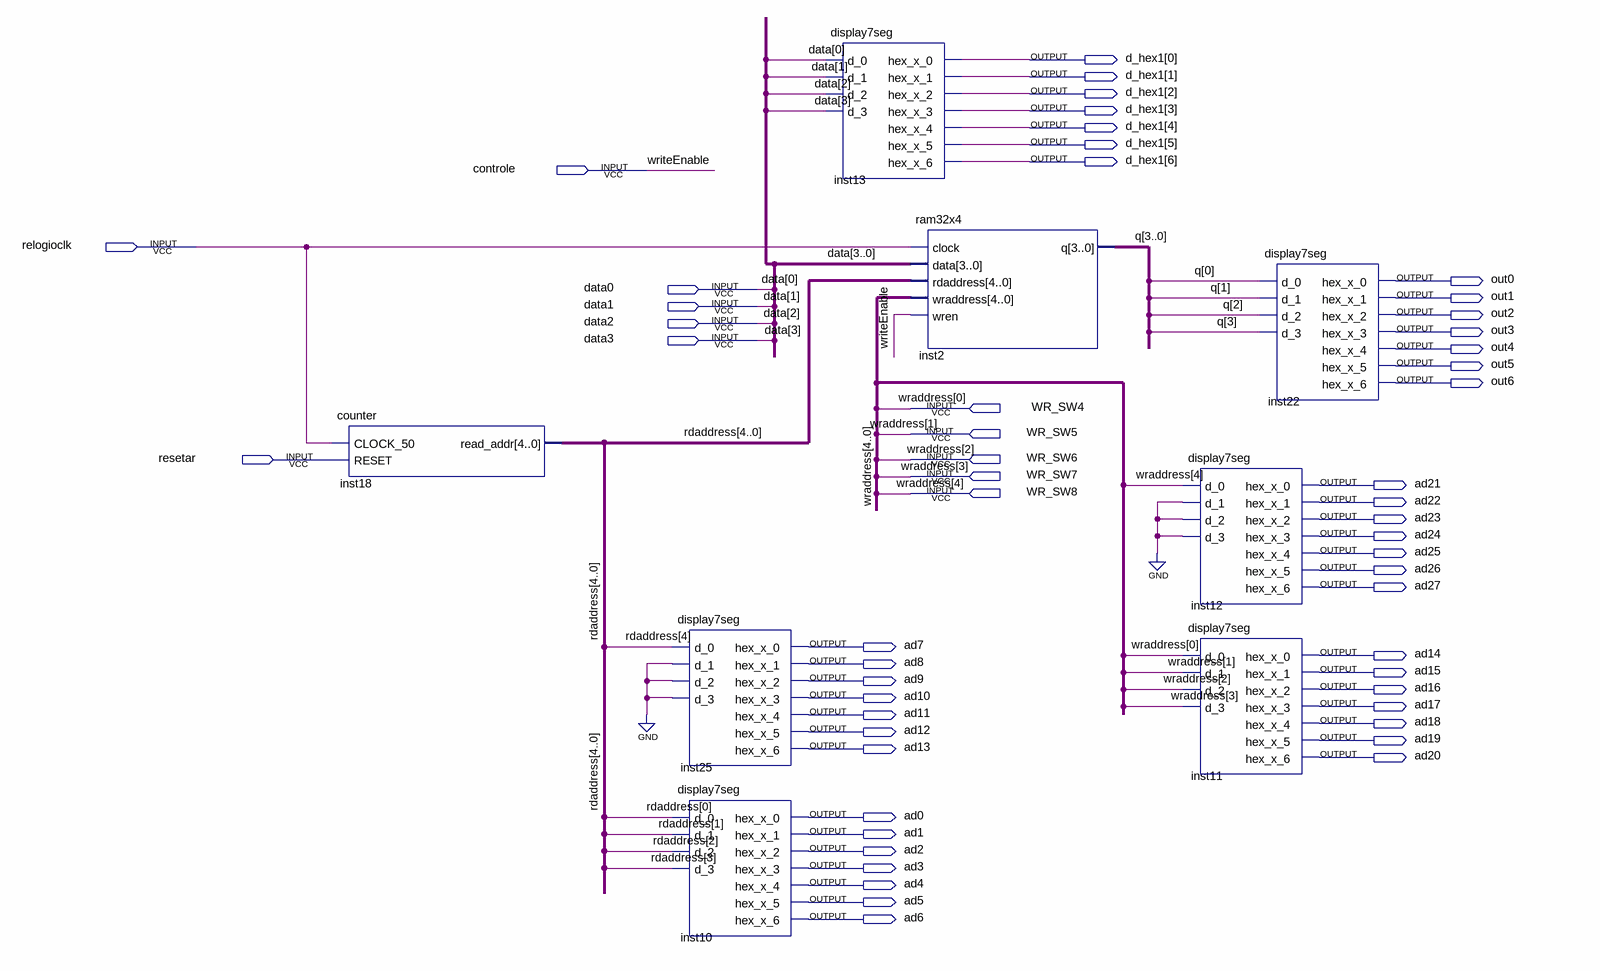
[diagram p0: schematic sheet]
// Quartus schematic praticaRAM4.bdf as structural Verilog: 8 symbols, 54 pins
module praticaRAM4 (
  input  controle,
  input  relogioclk,
  input  data0,
  input  data1,
  input  data2,
  input  data3,
  input  WR_SW4,
  input  WR_SW5,
  input  resetar,
  input  WR_SW6,
  input  WR_SW7,
  input  WR_SW8,
  output [6:0] d_hex1,
  output out0,
  output out1,
  output out2,
  output out3,
  output out4,
  output out5,
  output out6,
  output ad21,
  output ad22,
  output ad23,
  output ad24,
  output ad25,
  output ad26,
  output ad27,
  output ad7,
  output ad14,
  output ad8,
  output ad15,
  output ad9,
  output ad16,
  output ad10,
  output ad17,
  output ad11,
  output ad18,
  output ad12,
  output ad19,
  output ad13,
  output ad20,
  output ad0,
  output ad1,
  output ad2,
  output ad3,
  output ad4,
  output ad5,
  output ad6
);

  wire [3:0] q;
  wire [4:0] rdaddress;

  counter inst18 (.CLOCK_50(relogioclk), .RESET(resetar), .read_addr(rdaddress));
  display7seg inst25 (
    .d_0(rdaddress[4]), .d_1(1'b0), .d_2(1'b0), .d_3(1'b0), .hex_x_0(ad7), .hex_x_1(ad8), .hex_x_2(ad9),
    .hex_x_3(ad10), .hex_x_4(ad11), .hex_x_5(ad12), .hex_x_6(ad13));
  display7seg inst10 (
    .d_0(rdaddress[0]), .d_1(rdaddress[1]), .d_2(rdaddress[2]), .d_3(rdaddress[3]), .hex_x_0(ad0),
    .hex_x_1(ad1), .hex_x_2(ad2), .hex_x_3(ad3), .hex_x_4(ad4), .hex_x_5(ad5), .hex_x_6(ad6));
  display7seg inst13 (
    .d_0(data0), .d_1(data1), .d_2(data2), .d_3(data3), .hex_x_0(d_hex1[0]), .hex_x_1(d_hex1[1]),
    .hex_x_2(d_hex1[2]), .hex_x_3(d_hex1[3]), .hex_x_4(d_hex1[4]), .hex_x_5(d_hex1[5]), .hex_x_6(d_hex1[6]));
  ram32x4 inst2 (
    .clock(relogioclk), .data({data3, data2, data1, data0}), .rdaddress(rdaddress),
    .wraddress({WR_SW8, WR_SW7, WR_SW6, WR_SW5, WR_SW4}), .wren(controle), .q(q));
  display7seg inst12 (
    .d_0(WR_SW8), .d_1(1'b0), .d_2(1'b0), .d_3(1'b0), .hex_x_0(ad21), .hex_x_1(ad22), .hex_x_2(ad23),
    .hex_x_3(ad24), .hex_x_4(ad25), .hex_x_5(ad26), .hex_x_6(ad27));
  display7seg inst11 (
    .d_0(WR_SW4), .d_1(WR_SW5), .d_2(WR_SW6), .d_3(WR_SW7), .hex_x_0(ad14), .hex_x_1(ad15), .hex_x_2(ad16),
    .hex_x_3(ad17), .hex_x_4(ad18), .hex_x_5(ad19), .hex_x_6(ad20));
  display7seg inst22 (
    .d_0(q[0]), .d_1(q[1]), .d_2(q[2]), .d_3(q[3]), .hex_x_0(out0), .hex_x_1(out1), .hex_x_2(out2),
    .hex_x_3(out3), .hex_x_4(out4), .hex_x_5(out5), .hex_x_6(out6));

  // Other names for the same wires on the sheet: wraddress[4:0] = {WR_SW8, WR_SW7, WR_SW6, WR_SW5, WR_SW4};
  //   writeEnable = controle
endmodule
